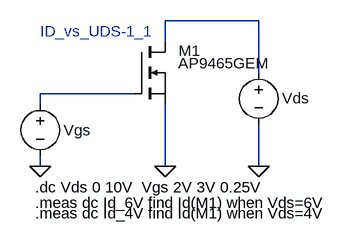
[diagram p0: schematic ID_vs_UDS-1_1.asc]
ID_vs_UDS-1_1.asc, the LTspice schematic file:
Version 4
SHEET 1 1292 680
WIRE -576 -96 -720 -96
WIRE -720 -64 -720 -96
WIRE -576 -16 -576 -96
WIRE -768 16 -912 16
WIRE -912 32 -912 16
WIRE -912 128 -912 112
WIRE -720 128 -720 32
WIRE -576 128 -576 64
FLAG -576 128 0
FLAG -912 128 0
FLAG -720 128 0
SYMBOL voltage -576 -32 R0
WINDOW 123 0 0 Left 2
WINDOW 39 37 60 Left 2
WINDOW 0 36 55 Left 2
WINDOW 3 37 60 Left 2
SYMATTR InstName Vds
SYMATTR Value ""
SYMBOL voltage -912 16 R0
WINDOW 123 0 0 Left 2
WINDOW 39 40 53 Left 2
WINDOW 3 40 69 Left 2
WINDOW 0 36 56 Left 2
SYMATTR Value ""
SYMATTR InstName Vgs
SYMBOL nmos -768 -64 R0
WINDOW 0 69 14 Left 2
WINDOW 3 68 33 Left 2
SYMATTR InstName M1
SYMATTR Value AP9465GEM
TEXT -920 160 Left 2 !.dc Vds 0 10V  Vgs 2V 3V 0.25V
TEXT -920 184 Left 2 !.meas dc Id_6V find Id(M1) when Vds=6V
TEXT -920 200 Left 2 !.meas dc Id_4V find Id(M1) when Vds=4V
TEXT -912 -80 Left 2 ;ID_vs_UDS-1_1

The netlist it stands for:
* ID_vs_UDS-1_1.asc
Vds N001 0
Vgs N002 0
M1 N001 N002 0 0 AP9465GEM
.model NMOS NMOS
.model PMOS PMOS
.lib standard.mos
.dc Vds 0 10V  Vgs 2V 3V 0.25V
.meas dc Id_6V find Id(M1) when Vds=6V
.meas dc Id_4V find Id(M1) when Vds=4V
* ID_vs_UDS-1_1
.backanno
.end